# Altium schematic sheet MIDI.Schematic.SchDoc
size A
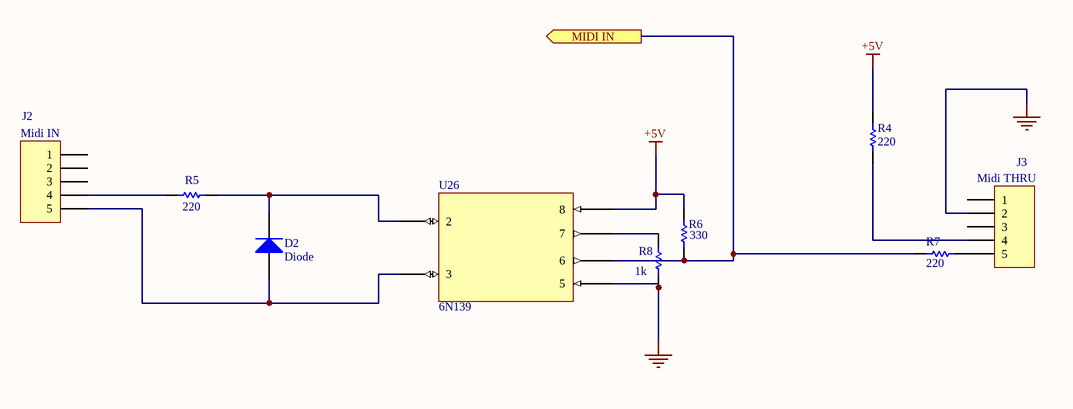
[diagram p0: MIDI.Schematic.SchDoc]

## Parts
D2  Diode  [SMC]
J2  Midi IN  [PCB DIN Socket]
J3  Midi THRU  [PCB DIN Socket]
R4  value 220  [CAPC1608N]  (hidden comment: Res1)
R5  value 220  [CAPC1608N]  (hidden comment: Res1)
R6  330  [CAPC1608N]
R7  value 220  [CAPC1608N]  (hidden comment: Res1)
R8  1k  [CAPC1608N]
U26  6N139  [6N139]

## Ports
MIDI IN (out)

## Nets
+5V: R4.2 R6.2 U26.?3(8)
GND: J3.2 R8.1 U26.?4(5)
MIDI IN: R6.1 R7.2 U26.?6(6) ; port MIDI IN
NetD2_1: D2.1(A) J2.5 U26.?1(3)
NetD2_2: D2.2(K) R5.2 U26.?2(2)
NetJ2_4: J2.4 R5.1
NetJ3_4: J3.4 R4.1
NetJ3_5: J3.5 R7.1
NetR8_2: R8.2 U26.?5(7)

Not connected (* = marked no-connect by the designer): J2 1 2 3; J3 1 3

## Library data of the parts
D2 = Diode: Default Diode; Published: 8-Jun-2000; LatestRevisionDate: 17-Jul-2002; LatestRevisionNote: Re-released for DXP Platform.; PackageVersion: Sep-1996; PackageReference: SMC; Publisher: Altium Limited; PackageDescription: DO-214-AB/SMC; 2 C-Bend Leads; Body 7.9 x 5.9 mm, inc. leads (LxW); Code_JEDEC: DO-214-AB
J2 J3 = Header 5: DIN 5 Pins; LatestRevisionDate: 17-Jul-2002; LatestRevisionNote: Re-released for DXP Platform.; Publisher: Altium Limited
R4-R8 = Res1: Resistor; Published: 8-Jun-2000; LatestRevisionDate: 17-Jul-2002; LatestRevisionNote: Re-released for DXP Platform.; PackageReference: AXIAL-0.3; Publisher: Altium Limited; PackageDescription: Axial Device, Thru-Hole; 2 Leads; 0.3 in Pin Spacing
  R6: Value: 330
  R8: Value: 1K